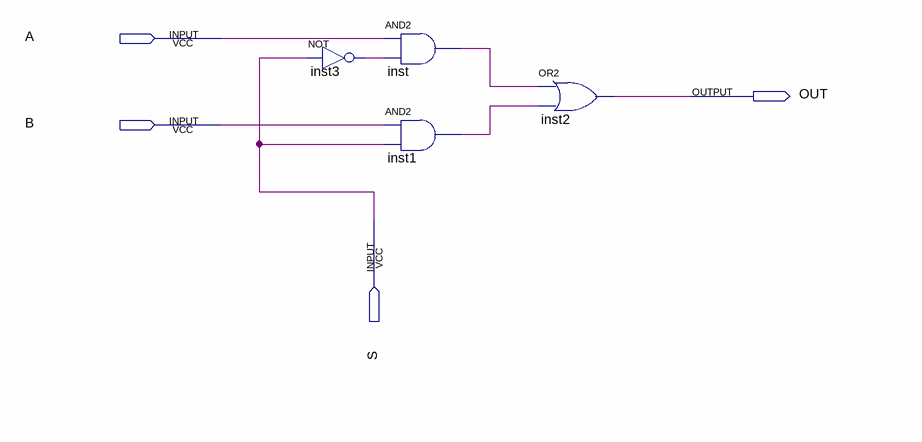
[diagram p0: schematic sheet]
// Quartus schematic MUX2-1.bdf as structural Verilog: 4 symbols, 4 pins
module \MUX2-1  (
  input  A,
  input  B,
  input  S,
  output OUT
);

  wire inst1_out, inst3_out, inst_out;

  not inst3 (inst3_out, S);
  and inst (inst_out, A, inst3_out);
  and inst1 (inst1_out, B, S);
  or inst2 (OUT, inst_out, inst1_out);
endmodule
